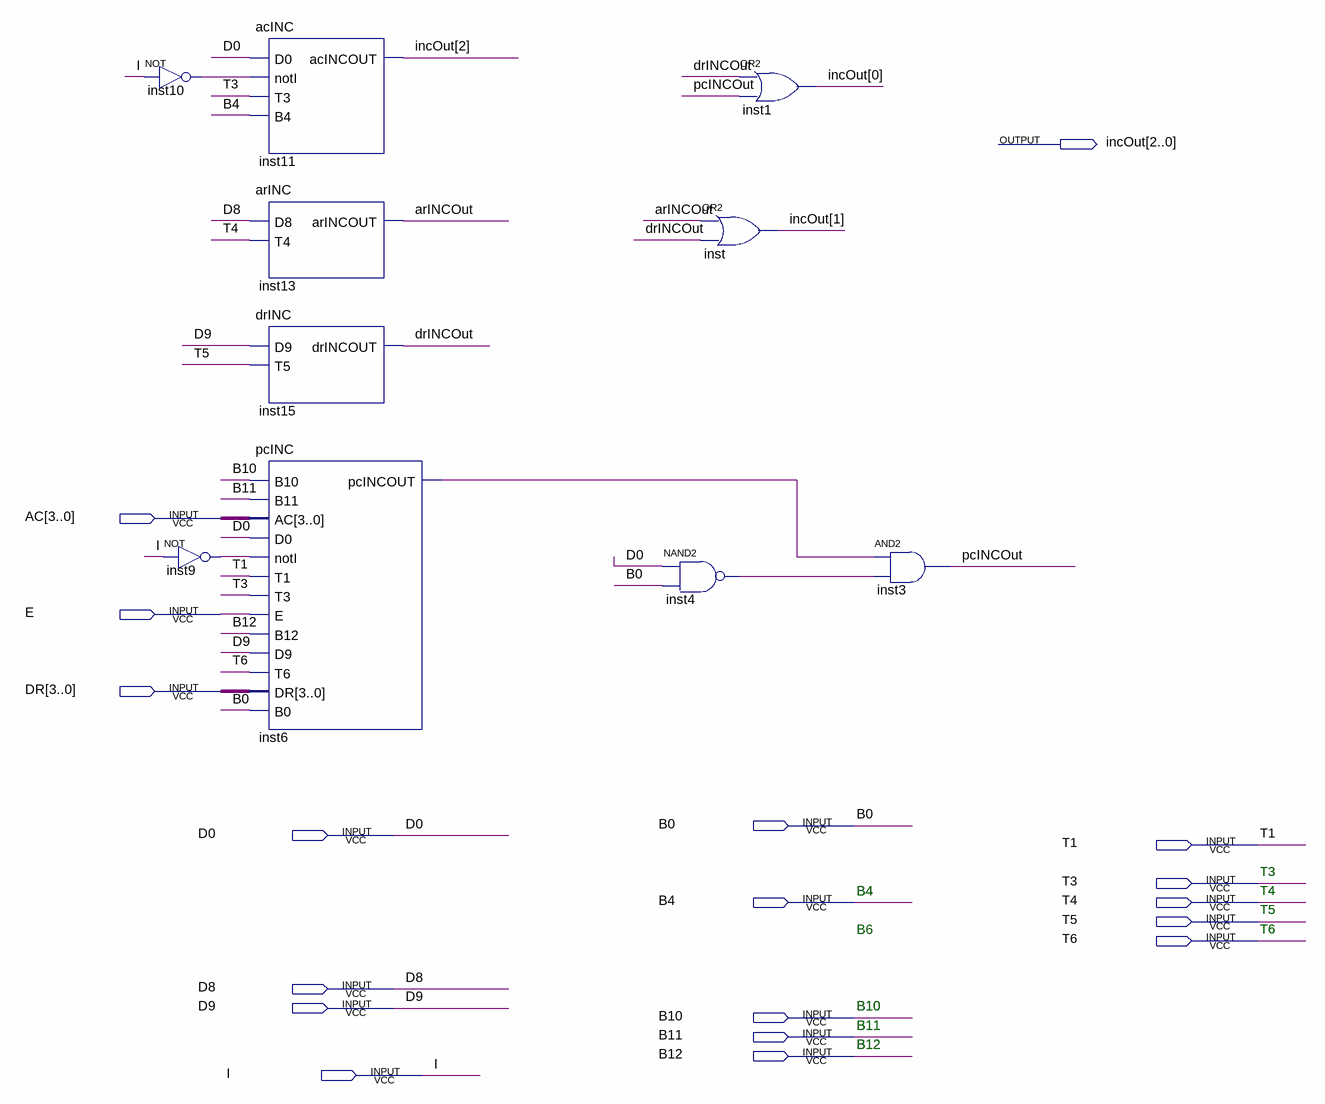
[diagram p0: schematic sheet]
// Quartus schematic incEncode.bdf as structural Verilog: 10 symbols, 18 pins
module incEncode (
  input  [3:0] AC,
  input  E,
  input  [3:0] DR,
  input  B0,
  input  D0,
  input  T1,
  input  T3,
  input  B4,
  input  T4,
  input  T5,
  input  T6,
  input  D8,
  input  D9,
  input  B10,
  input  B11,
  input  B12,
  input  I,
  output [2:0] incOut
);

  wire arINCOut, drINCOut, inst4_out, inst6_pcincout, inst9_out, inst10_out, pcINCOut;

  not inst10 (inst10_out, I);
  not inst9 (inst9_out, I);
  acINC inst11 (.D0(D0), .notI(inst10_out), .T3(T3), .B4(B4), .acINCOUT(incOut[2]));
  arINC inst13 (.D8(D8), .T4(T4), .arINCOUT(arINCOut));
  drINC inst15 (.D9(D9), .T5(T5), .drINCOUT(drINCOut));
  pcINC inst6 (
    .B10(B10), .B11(B11), .AC(AC), .D0(D0), .notI(inst9_out), .T1(T1), .T3(T3), .E(E), .B12(B12), .D9(D9),
    .T6(T6), .DR(DR), .B0(B0), .pcINCOUT(inst6_pcincout));
  or inst (incOut[1], arINCOut, drINCOut);
  nand inst4 (inst4_out, D0, B0);
  or inst1 (incOut[0], drINCOut, pcINCOut);
  and inst3 (pcINCOut, inst6_pcincout, inst4_out);

  // Notes on the sheet:
  //   T3
  //   B4
  //   T4
  //   T5
  //   B6
  //   T6
  //   B10
  //   B11
  //   B12
endmodule
